# EAGLE design Remora (EAGLE 7.4.0)
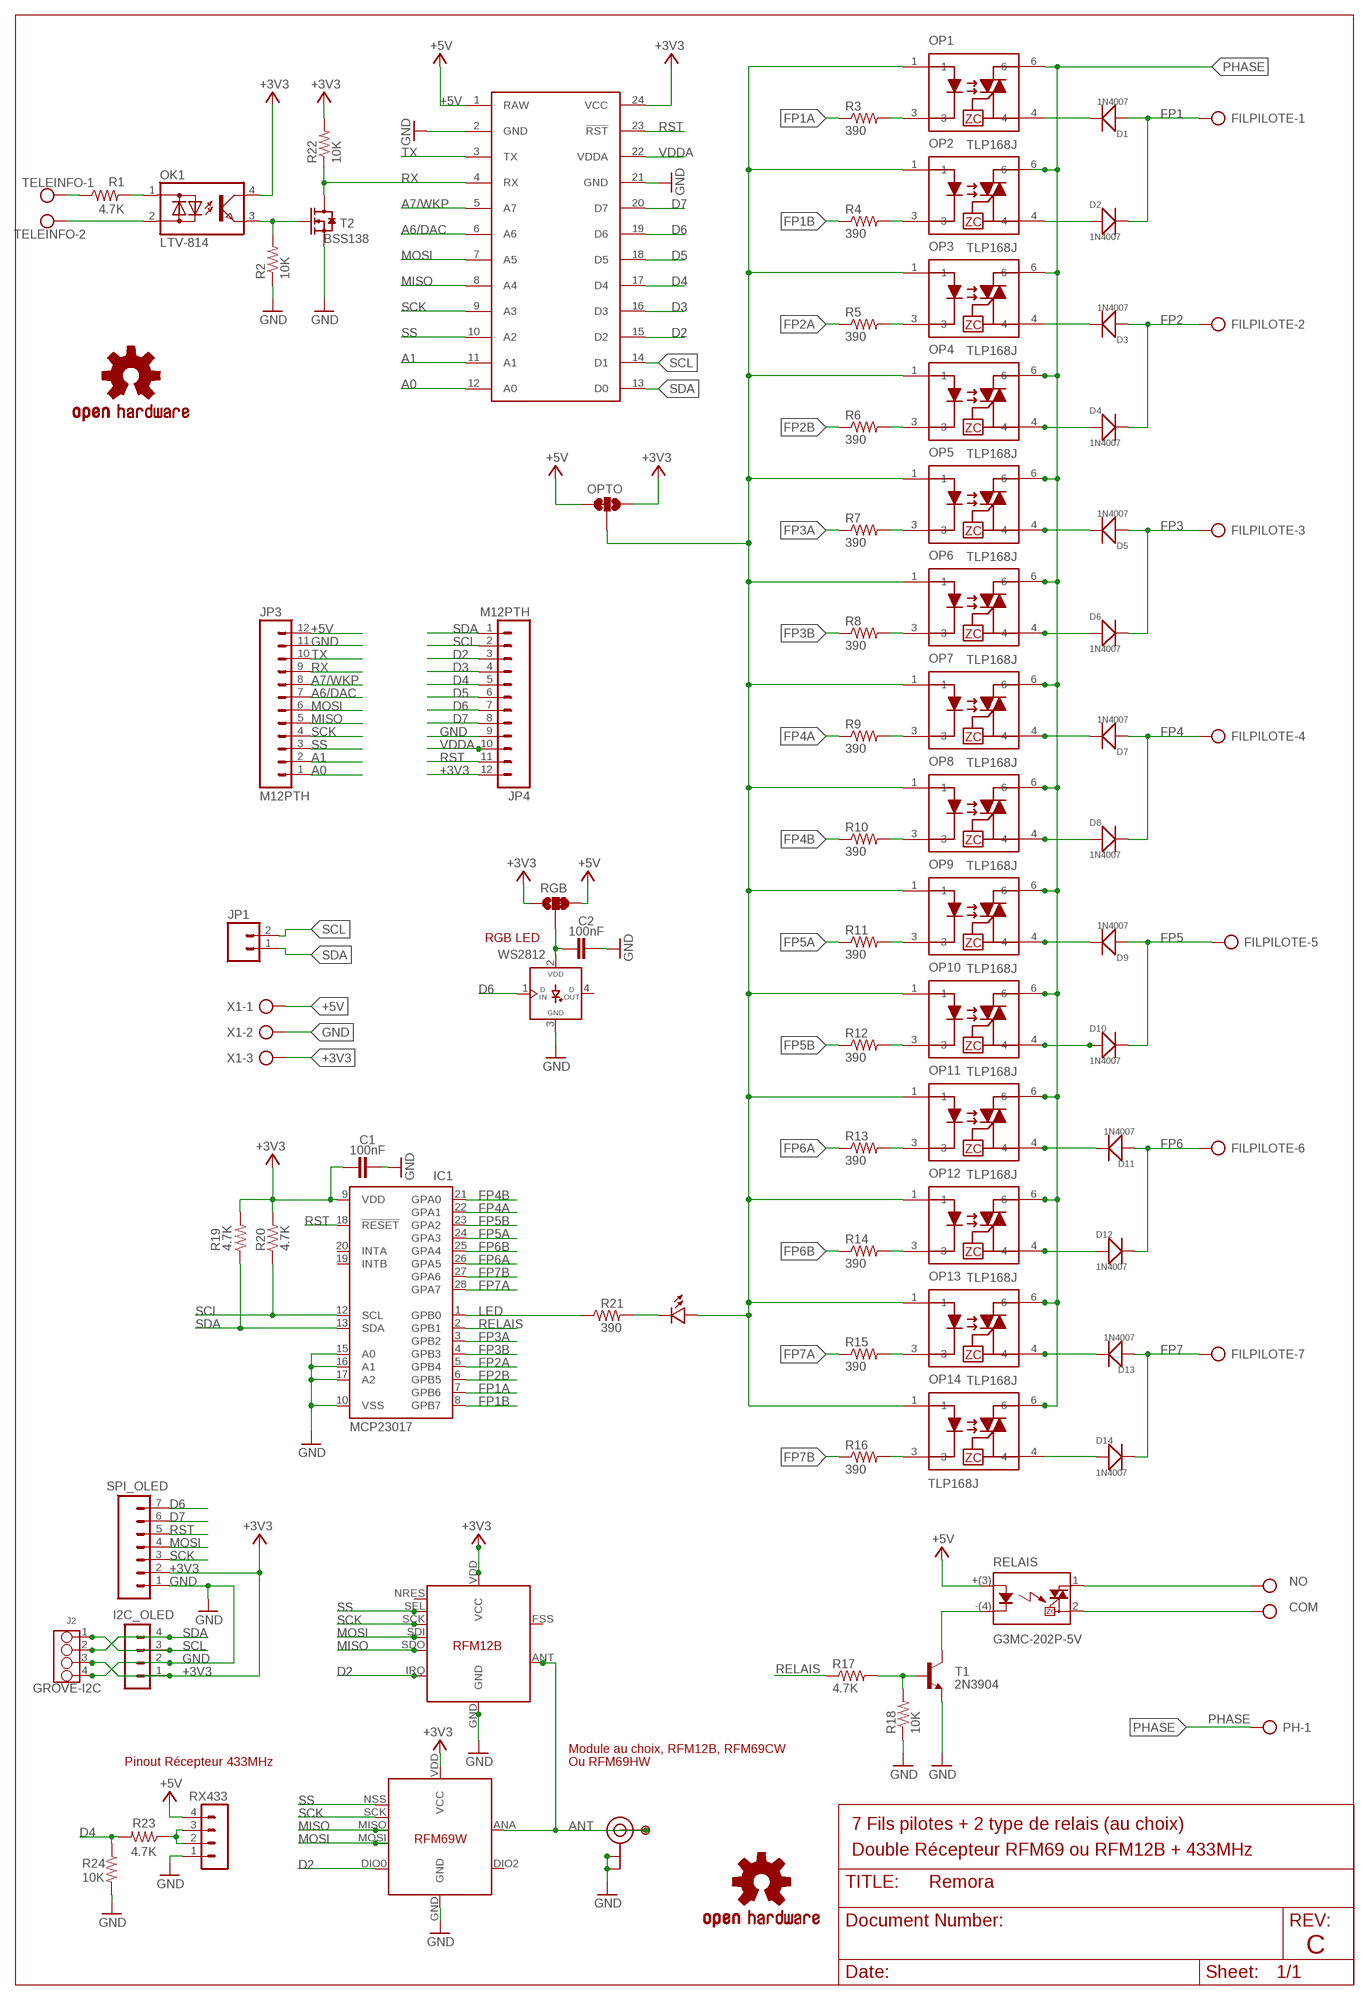
[diagram p0: schematic, sheet 1]

## Parts
C1  100nF  CAP'1206-CAP'  [1206-CAP]
C2  100nF  CAP'1206-CAP'  [1206-CAP]
D1  1N4007  DIODE'SMA'  [DO-214AC]
D2  1N4007  DIODE'SMA'  [DO-214AC]
D3  1N4007  DIODE'SMA'  [DO-214AC]
D4  1N4007  DIODE'SMA'  [DO-214AC]
D5  1N4007  DIODE'SMA'  [DO-214AC]
D6  1N4007  DIODE'SMA'  [DO-214AC]
D7  1N4007  DIODE'SMA'  [DO-214AC]
D8  1N4007  DIODE'SMA'  [DO-214AC]
D9  1N4007  DIODE'SMA'  [DO-214AC]
D10  1N4007  DIODE'SMA'  [DO-214AC]
D11  1N4007  DIODE'SMA'  [DO-214AC]
D12  1N4007  DIODE'SMA'  [DO-214AC]
D13  1N4007  DIODE'SMA'  [DO-214AC]
D14  1N4007  DIODE'SMA'  [DO-214AC]
FILPILOTE  AK500/7  [AK500/7]
I2C_OLED  CON_HEADER_1X04'SMALL''  [M1X4]
IC1  MCP23017  MCP23017SP  [DIL28-3]
J2  GROVE-I2C  GROVE-4P-2.0-3470130P1  [4P-2.0]
JP1  M02PTH  [1X02]
JP3  M12PTH  [1X12-SMALL-PADS]
JP4  M12PTH  [1X12-SMALL-PADS]
LED  LED3MM  [LED3MM]
LOGO1  OSHW-LOGOL  [OSHW-LOGO-L]
LOGO2  OSHW-LOGOL  [OSHW-LOGO-L]
OK1  LTV-814  SFH6206  [DIL4-SMD]
OP1  TLP168J  TLP168JBIGPAD  [MFSOP-4-HANDSOLDER]
OP2  TLP168J  TLP168JBIGPAD  [MFSOP-4-HANDSOLDER]
OP3  TLP168J  TLP168JBIGPAD  [MFSOP-4-HANDSOLDER]
OP4  TLP168J  TLP168JBIGPAD  [MFSOP-4-HANDSOLDER]
OP5  TLP168J  TLP168JBIGPAD  [MFSOP-4-HANDSOLDER]
OP6  TLP168J  TLP168JBIGPAD  [MFSOP-4-HANDSOLDER]
OP7  TLP168J  TLP168JBIGPAD  [MFSOP-4-HANDSOLDER]
OP8  TLP168J  TLP168JBIGPAD  [MFSOP-4-HANDSOLDER]
OP9  TLP168J  TLP168JBIGPAD  [MFSOP-4-HANDSOLDER]
OP10  TLP168J  TLP168JBIGPAD  [MFSOP-4-HANDSOLDER]
OP11  TLP168J  TLP168JBIGPAD  [MFSOP-4-HANDSOLDER]
OP12  TLP168J  TLP168JBIGPAD  [MFSOP-4-HANDSOLDER]
OP13  TLP168J  TLP168JBIGPAD  [MFSOP-4-HANDSOLDER]
OP14  TLP168J  TLP168JBIGPAD  [MFSOP-4-HANDSOLDER]
OPTO  JUMPER-PAD-3-2OF3_NC_BY_TRACE_LARGE  [PAD-JUMPER-3-2OF3_NC_BY_TRACE_YES_SILK_LARGE]
P1  PADSMALL  [PAD-SMALL]
PARTICLE  Spark/Photon  SPARK_CORECORE  [SPARK_CORE]
PH  AK500/3  [AK500/3]
R1  4.7K  RESISTOR'1206-RES''  [1206-RES]
R2  10K  RESISTOR'1206-RES''  [1206-RES]
R3  390  RESISTOR'1206-RES''  [1206-RES]
R4  390  RESISTOR'1206-RES''  [1206-RES]
R5  390  RESISTOR'1206-RES''  [1206-RES]
R6  390  RESISTOR'1206-RES''  [1206-RES]
R7  390  RESISTOR'1206-RES''  [1206-RES]
R8  390  RESISTOR'1206-RES''  [1206-RES]
R9  390  RESISTOR'1206-RES''  [1206-RES]
R10  390  RESISTOR'1206-RES''  [1206-RES]
R11  390  RESISTOR'1206-RES''  [1206-RES]
R12  390  RESISTOR'1206-RES''  [1206-RES]
R13  390  RESISTOR'1206-RES''  [1206-RES]
R14  390  RESISTOR'1206-RES''  [1206-RES]
R15  390  RESISTOR'1206-RES''  [1206-RES]
R16  390  RESISTOR'1206-RES''  [1206-RES]
R17  4.7K  RESISTOR'1206-RES''  [1206-RES]
R18  10K  RESISTOR'1206-RES''  [1206-RES]
R19  4.7K  RESISTOR'1206-RES''  [1206-RES]
R20  4.7K  RESISTOR'1206-RES''  [1206-RES]
R21  390  RESISTOR'1206-RES''  [1206-RES]
R22  10K  RESISTOR'1206-RES''  [1206-RES]
R23  4.7K  RESISTOR'1206-RES''  [1206-RES]
R24  10K  RESISTOR'1206-RES''  [1206-RES]
RELAIS  G3MC-202P-5V  G3MC-202P  [SIP-4]
RGB  JUMPER-PAD-3-2OF3_NC_BY_TRACE_SMALL  [PAD-JUMPER-3-2OF3_NC_BY_TRACE_YES_SILK_FULL_BOX]
RX433  CON_HEADER_1X04'NO_LOCK'  [1X04_NO_LOCK]
SPI_OLED  CON_HEADER_1X07'SMALL'  [M1X7]
T1  2N3904  2N2222-NPN-TO92-EBC  [TO92-EBC]
T2  BSS138  MOSFET-N-''  [SOT23]
TELEINFO  AK500/2  [AK500/2]
U$2  RFM12B  [RFM12B-MINPADS]
U$3  RFM69W  [RFM69W-MINPADS]
U-FL  U.FL  [U.FL]
WS2812  RGB LED  WS2812B5MM  [WS2812-PTH]
X1  AK500/3  [AK500/3]

## Nets
+3V3: C1.1 I2C_OLED.1 IC1.9(VDD) J2.3 JP4.12 OK1.4(C) OPTO.1 PARTICLE.24(VCC) R19.2 R20.2 R22.2 RGB.1 SPI_OLED.2 U$2.VDD(VCC) U$3.VDD(VCC) X1.3
+5V: JP3.12 OPTO.3 PARTICLE.1(RAW) RELAIS.+(3) RGB.3 RX433.4 X1.1
A0: JP3.1 PARTICLE.12(A0)
A1: JP3.2 PARTICLE.11(A1)
A6/DAC: JP3.7 PARTICLE.6(A6)
A7/WKP: JP3.8 PARTICLE.5(A7)
ANT: P1.1 U$2.ANT U$3.ANA(ANT) U-FL.3(SIGNAL)
COM: PH.3 RELAIS.2
D2: JP4.3 PARTICLE.15(D2) U$2.IRQ U$3.DIO0
D3: JP4.4 PARTICLE.16(D3)
D4: JP4.5 PARTICLE.17(D4) R23.2 R24.1
D5: JP4.6 PARTICLE.18(D5)
D6: JP4.7 PARTICLE.19(D6) SPI_OLED.7 WS2812.1(DIN)
D7: JP4.8 PARTICLE.20(D7) SPI_OLED.6
FP1: D1.1(+) D2.2(-) FILPILOTE.1
FP1A: IC1.7(GPB6) R3.1
FP1B: IC1.8(GPB7) R4.1
FP2: D3.1(+) D4.2(-) FILPILOTE.2
FP2A: IC1.5(GPB4) R5.1
FP2B: IC1.6(GPB5) R6.1
FP3: D5.1(+) D6.2(-) FILPILOTE.3
FP3A: IC1.3(GPB2) R7.1
FP3B: IC1.4(GPB3) R8.1
FP4: D7.1(+) D8.2(-) FILPILOTE.4
FP4A: IC1.22(GPA1) R9.1
FP4B: IC1.21(GPA0) R10.1
FP5: D9.1(+) D10.2(-) FILPILOTE.5
FP5A: IC1.24(GPA3) R11.1
FP5B: IC1.23(GPA2) R12.1
FP6: D11.1(+) D12.2(-) FILPILOTE.6
FP6A: IC1.26(GPA5) R13.1
FP6B: IC1.25(GPA4) R14.1
FP7: D13.1(+) D14.2(-) FILPILOTE.7
FP7A: IC1.28(GPA7) R15.1
FP7B: IC1.27(GPA6) R16.1
GND: C1.2 C2.2 I2C_OLED.2 IC1.10(VSS) IC1.15(A0) IC1.16(A1) IC1.17(A2) J2.4 JP3.11 JP4.9 PARTICLE.2(GND) PARTICLE.21(GND) R2.1 R18.1 R24.2 RX433.1 SPI_OLED.1 T1.E T2.2(S) U$2.GND U$3.GND U-FL.1(GND) U-FL.2(GND) WS2812.3(GND) X1.2
LED: IC1.1(GPB0) R21.1
MISO: JP3.5 PARTICLE.8(A4) U$2.SDO U$3.MISO
MOSI: JP3.6 PARTICLE.7(A5) SPI_OLED.4 U$2.SDI U$3.MOSI
N$1: D1.2(-) OP1.4
N$2: D2.1(+) OP2.4
N$3: OK1.2(AC2) TELEINFO.2
N$4: OK1.1(AC1) R1.2
N$5: R1.1 TELEINFO.1
N$6: LED.MINUS R21.2
N$7: OP1.3 R3.2
N$8: OP2.3 R4.2
N$9: OP3.3 R5.2
N$10: OP4.3 R6.2
N$11: OP5.3 R7.2
N$12: OP6.3 R8.2
N$13: OP7.3 R9.2
N$14: OP8.3 R10.2
N$15: RELAIS.-(4) T1.C
N$16: C2.1 RGB.2 WS2812.2(VDD)
N$17: OK1.3(E) R2.2 T2.1(G)
N$18: OP9.3 R11.2
N$19: LED.PLUS OP1.1 OP2.1 OP3.1 OP4.1 OP5.1 OP6.1 OP7.1 OP8.1 OP9.1 OP10.1 OP11.1 OP12.1 OP13.1 OP14.1 OPTO.2
N$21: R17.2 R18.2 T1.B
N$22: D3.2(-) OP3.4
N$24: D5.2(-) OP5.4
N$25: D4.1(+) OP4.4
N$26: D7.2(-) OP7.4
N$29: D6.1(+) OP6.4
N$31: D8.1(+) OP8.4
N$32: OP10.3 R12.2
N$34: OP14.3 R16.2
N$42: D9.2(-) OP9.4
N$47: OP11.3 R13.2
N$48: OP12.3 R14.2
N$49: D10.1(+) OP10.4
N$51: D12.1(+) OP12.4
NO: PH.2 RELAIS.1
PHASE: OP1.6 OP2.6 OP3.6 OP4.6 OP5.6 OP6.6 OP7.6 OP8.6 OP9.6 OP10.6 OP11.6 OP12.6 OP13.6 OP14.6 PH.1
RELAIS: IC1.2(GPB1) R17.1
RST: IC1.18(!RESET) JP4.11 PARTICLE.23(!RST) SPI_OLED.5
RX: JP3.9 PARTICLE.4(RX) R22.1 T2.3(D)
RX433: R23.1 RX433.2 RX433.3
S$1: D11.2(-) OP11.4
S$3: D13.2(-) OP13.4
S$5: OP13.3 R15.2
S$11: D14.1(+) OP14.4
SCK: JP3.4 PARTICLE.9(A3) SPI_OLED.3 U$2.SCK U$3.SCK
SCL: I2C_OLED.3 IC1.12(SCL) J2.1 JP1.2 JP4.2 PARTICLE.14(D1) R20.1
SDA: I2C_OLED.4 IC1.13(SDA) J2.2 JP1.1 JP4.1 PARTICLE.13(D0) R19.1
SS: JP3.3 PARTICLE.10(A2) U$2.SEL U$3.NSS(SEL)
TX: JP3.10 PARTICLE.3(TX)
VDDA: JP4.10 PARTICLE.22(VDDA)
Unconnected: IC1.19(INTB) IC1.20(INTA) U$2.FSS(FFS) U$2.NRES U$3.DIO2 WS2812.4(DOUT)

## Notes on the sheet
- RGB LED
- Module au choix, RFM12B, RFM69CW
- Pinout Récepteur 433MHz | Ou RFM69HW
- 7 Fils pilotes + 2 type de relais (au choix)
- Double Récepteur RFM69 ou RFM12B + 433MHz
- C

## Library data of the parts
C1 C2 = _c2h:CAP: Capacitor Standard 0603 ceramic capacitor, and 0.1" leaded capacitor.
D1-D14 = seeed-opl-Discrete:DIODE*
FILPILOTE = con-ptr500:AK500/7: CONNECTOR; OC_FARNELL: unknown; OC_NEWARK: unknown
I2C_OLED RX433 = _c2h:CON_HEADER_1X04
IC1 = adafruit:MCP23017: http://ww1.microchip.com/downloads/en/DeviceDoc/21952a.pdf Source: http://ww1.microchip.com/downloads/en/DeviceDoc/21952a.pdf
J2 = seeed-opl-Connector:GROVE-4P-2.0
JP1 = SparkFun-Connectors:M02: Standard 2-pin 0.1" header. Use with - straight break away headers ( PRT-00116) - right angle break away headers (PRT-00553) - swiss pins (PRT-00743) - machine pins (PRT-00117) - female headers (PRT-00115) Molex polarized connector foot print use with: PRT-08233 with associated crimp pins and housings. 2.54_SCREWTERM for use with PRT-10571. 3.5mm Screw Terminal footprints for PRT-08084 5mm Screw Terminal footprints for use with PRT-08432
JP3 JP4 = Spark:M12: Header 12 Standard 12-pin 0.1" header. Use with straight break away headers (SKU : PRT-00116), right angle break away headers (PRT-00553), swiss pins (PRT-00743), machine pins (PRT-00117), and female headers (PRT-00115).
LED = _c2h:LED
LOGO1 LOGO2 = SparkFun-Aesthetics:OSHW-LOGO: Open Source Hardware Logo This logo indicates the piece of hardware it is found on incorporates a OSHW license and/or adheres to the definition of open source hardware found here: http://freedomdefined.org/OSHW
OK1 = optocoupler:SFH620: Optocoupler, Phototransistor Output, AC Input Source: http://www.vishay.com/docs/83675/sfh620.pdf; MF: VISHAY/TELEFUNKEN; MPN: SFH6206-3; OC_FARNELL: 1469585; OC_NEWARK: 58K2214
OP1-OP14 = TLP168J:TLP168J
OPTO RGB = SparkFun-Passives:JUMPER-PAD-3-2OF3_NC_BY_TRACE
P1 = SteveMarple:PAD
PARTICLE = Spark:SPARK_CORE
PH X1 = con-ptr500:AK500/3: CONNECTOR; OC_FARNELL: unknown; OC_NEWARK: unknown
R1-R24 = _c2h:RESISTOR: Resistor Basic schematic elements and footprints for 0603, 1206, and PTH resistors.
RELAIS = sip-4:G3MC-202P
SPI_OLED = _c2h:CON_HEADER_1X07
T1 = transistor-neu-to92:*-NPN-: NPN Transistror
T2 = Seeed-Discrete:MOSFET-N: CJ2302：SMD MOSFET N-CH 20V-2.1A
TELEINFO = con-ptr500:AK500/2: CONNECTOR; OC_FARNELL: unknown; OC_NEWARK: unknown
U$2 = _c2h:RFM12B
U$3 = _c2h:RFM69W
U-FL = microbuilder:U.FL: U.FL Antenna Connector
WS2812 = _c2h:WS2812B

## Net classes
0 default: width 0.203 mm, drill 0.305 mm, clearance 0.254 mm

## Board
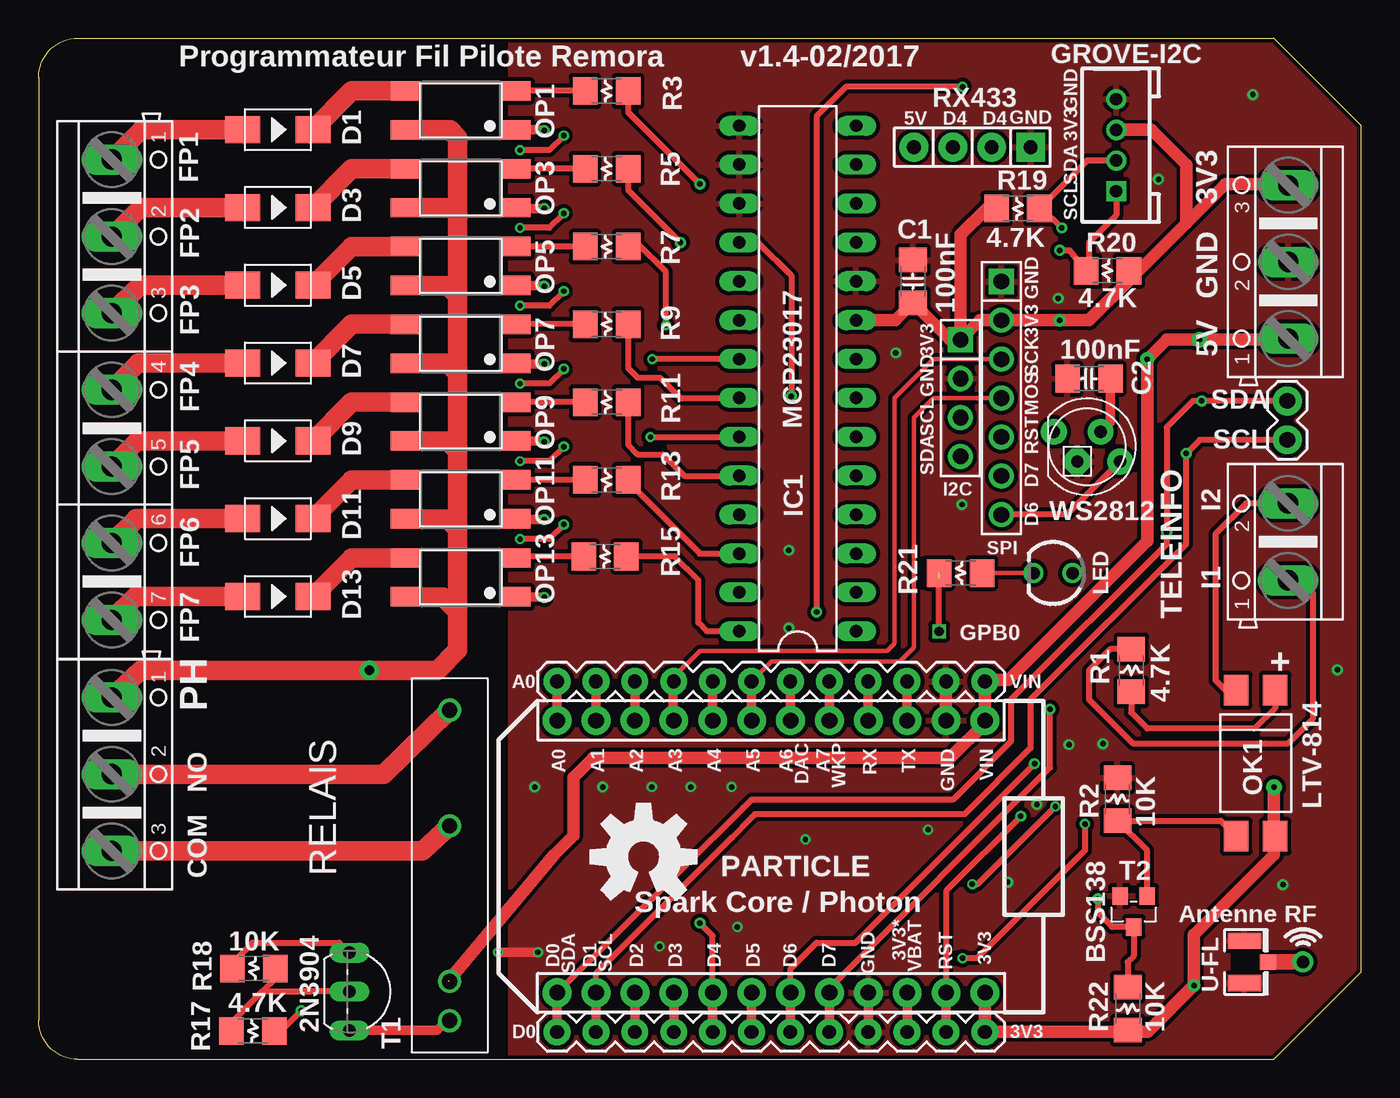
[diagram p1: board, top side]
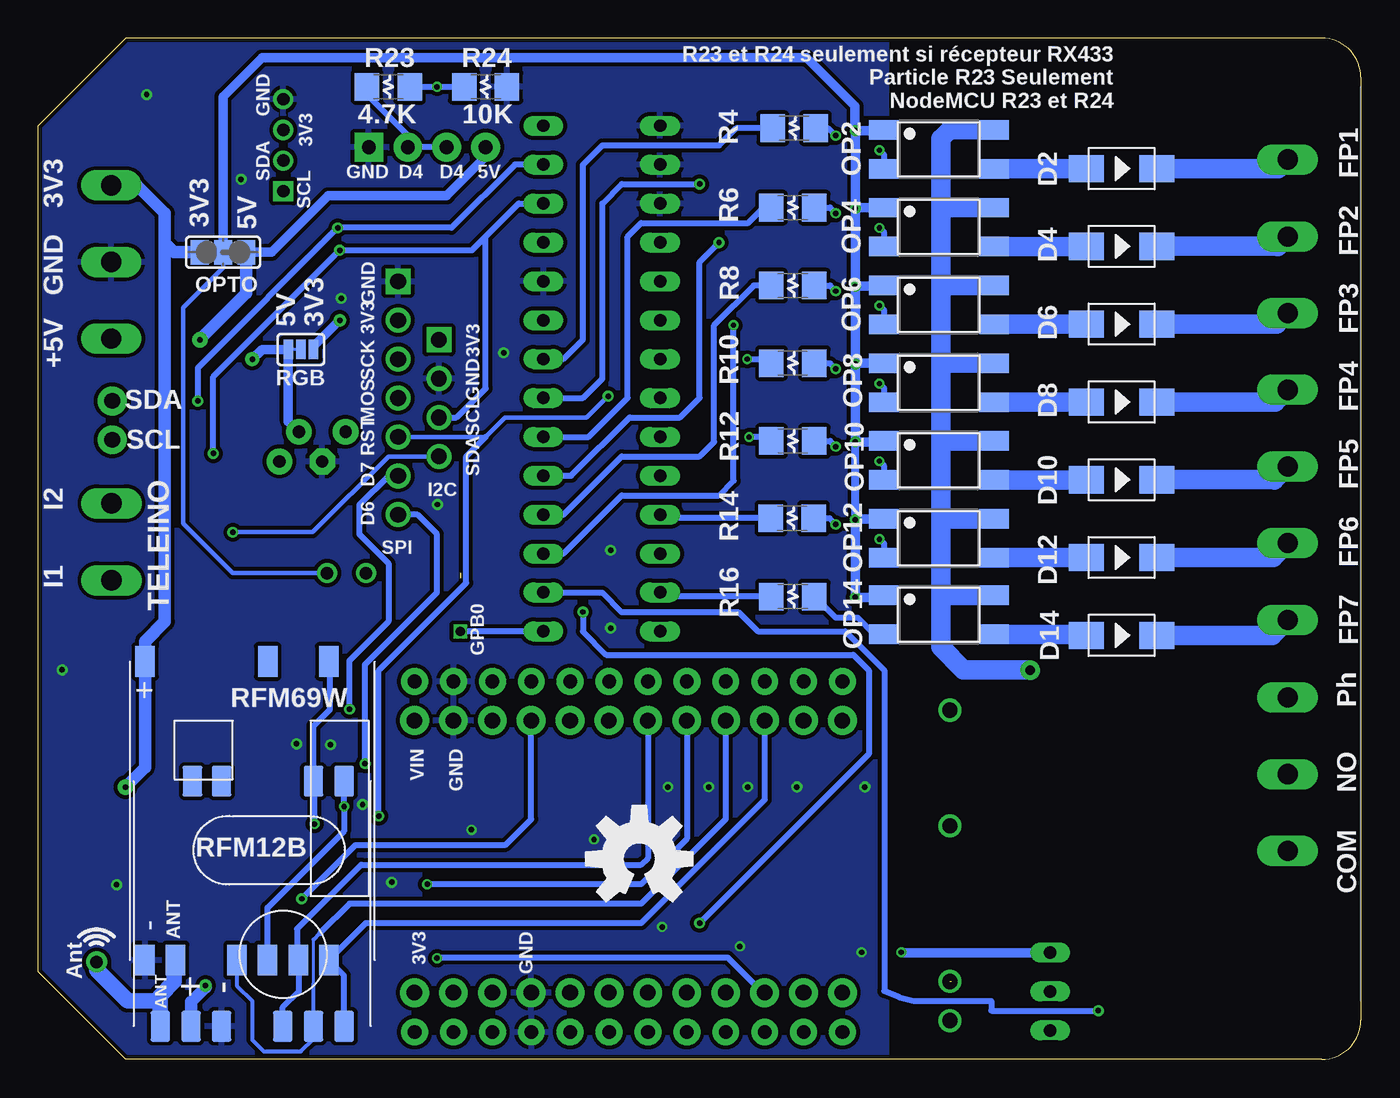
[diagram p2: board, bottom side, seen from below]

Size 86.36 x 66.67 mm. Coordinates in mm from the lower left corner, seen from the top.
Outline: 2.54,0 80.64,0 86.36,5.71 86.36,60.96 80.64,66.67 2.54,66.67 arc90 0,64.14 0,2.54 arc90 2.54,0
Copper layers (1*16): Top 0.035mm / dielectric 1.5mm / Bottom 0.035mm
Design rules "SeeedStudio_2layer_DRU_no_angle_20140221": minimum track width 6mil, minimum drill 12mil, track to track 6mil, track to pad 6mil, pad to pad 6mil, via to via 6mil, smd to smd 0mil, copper to edge 10mil, drill to drill 10mil, minimum pad ring 10mil, minimum via ring 6mil, stop-mask expansion 2mil, vias tented up to drill 100mil, thermal gap 10mil

### Footprints (pad centres in the part's own frame; a part is rotated, then mirrored left to right if it is on the bottom)
1206-CAP = smd 1.6 x 1.8: 1 -1.4,0; 2 1.4,0
DO-214AC = smd 2.286 x 1.77: 1 -2.296,0; 2 2.296,0
AK500/7 = drill 1.321 long: 1 -15.037,0; 2 -10.008,0; 3 -5.004,0; 4 0,0; 5 5.004,0; 6 10.008,0; 7 15.037,0
M1X4 = drill 1.02 pad 1.632 square: 1 -3.81,0 | drill 1.02 pad 1.632: 2 -1.27,0; 3 1.27,0; 4 3.81,0
DIL28-3 = drill 0.813 long: 1 -16.51,-3.81; 2 -13.97,-3.81; 3 -11.43,-3.81; 4 -8.89,-3.81; 5 -6.35,-3.81; 6 -3.81,-3.81; 7 -1.27,-3.81; 8 1.27,-3.81; 9 3.81,-3.81; 10 6.35,-3.81; 11 8.89,-3.81; 12 11.43,-3.81; 13 13.97,-3.81; 14 16.51,-3.81; 15 16.51,3.81; 16 13.97,3.81; 17 11.43,3.81; 18 8.89,3.81; 19 6.35,3.81; 20 3.81,3.81; 21 1.27,3.81; 22 -1.27,3.81; 23 -3.81,3.81; 24 -6.35,3.81; 25 -8.89,3.81; 26 -11.43,3.81; 27 -13.97,3.81; 28 -16.51,3.81
4P-2.0 = drill 0.8 pad 1.27 square: 1 -3,0 | drill 0.8 pad 1.27: 2 -1,0; 3 1,0; 4 3,0
1X02 = drill 1.016 pad 1.88: 1 0,0; 2 2.54,0
1X12-SMALL-PADS = drill 0.889 pad 1.753: 1 0,0; 2 2.54,0; 3 5.08,0; 4 7.62,0; 5 10.16,0; 6 12.7,0; 7 15.24,0; 8 17.78,0; 9 20.32,0; 10 22.86,0; 11 25.4,0; 12 27.94,0
LED3MM = drill 0.813: MINUS 1.27,0; PLUS -1.27,0
DIL4-SMD = smd 1.6 x 2: 1 -1.27,-4.77; 2 1.27,-4.77; 3 1.27,4.77; 4 -1.27,4.77
MFSOP-4-HANDSOLDER = smd 1.27 x 2.032: 1 2.54,0.381; 3 0,0.381; 4 0,-6.731; 6 2.54,-6.731
PAD-JUMPER-3-2OF3_NC_BY_TRACE_YES_SILK_LARGE = smd 1.168 x 1.6: 1 -1.524,0; 2 0,0; 3 1.524,0
PAD-SMALL = drill 0.813 pad 1.372: 1 0,0
SPARK_CORE = drill 1.016 pad 1.88: 1 -8.89,13.97; 2 -8.89,11.43; 3 -8.89,8.89; 4 -8.89,6.35; 5 -8.89,3.81; 6 -8.89,1.27; 7 -8.89,-1.27; 8 -8.89,-3.81; 9 -8.89,-6.35; 10 -8.89,-8.89; 11 -8.89,-11.43; 12 -8.89,-13.97; 13 8.89,-13.97; 14 8.89,-11.43; 15 8.89,-8.89; 16 8.89,-6.35; 17 8.89,-3.81; 18 8.89,-1.27; 19 8.89,1.27; 20 8.89,3.81; 21 8.89,6.35; 22 8.89,8.89; 23 8.89,11.43; 24 8.89,13.97
AK500/3 = drill 1.321 long: 1 -5.004,0; 2 0,0; 3 5.004,0
1206-RES = smd 1.6 x 1.8: 1 -1.4,0; 2 1.4,0
SIP-4 = drill 1: 1 10.1,-0.04; 2 2.54,-0.04; +(3) -7.62,-0.04; -(4) -10.18,-0.04
PAD-JUMPER-3-2OF3_NC_BY_TRACE_YES_SILK_FULL_BOX = smd 0.635 x 1.27: 1 -0.813,0; 2 0,0; 3 0.813,0
1X04_NO_LOCK = drill 0.9 pad 1.88 square: 1 -3.816,-0.121 | drill 0.9 pad 1.88: 2 -1.27,-0.133; 3 1.27,-0.121; 4 3.81,-0.133
M1X7 = drill 1.02 pad 1.632 square: 1 -6.35,0 | drill 1.02 pad 1.632: 2 -3.81,0; 3 -1.27,0; 4 1.27,0; 5 3.81,0; 6 6.35,0; 7 8.89,0
TO92-EBC = drill 0.813 long: B 0,-1.27; C 2.54,-1.27; E -2.54,-1.27
SOT23 = smd 1.016 x 1.143: 1 -0.889,-1.016; 2 0.889,-1.016; 3 0,1.016
AK500/2 = drill 1.321 long: 1 -2.515,0; 2 2.515,0
RFM12B-MINPADS = smd 2 x 1.27: ANT 8,-6; FSS -8.002,-2; GND 8,-2; IRQ -8,4; NRES -8.002,-3.905; SCK 8,4; SDI 8,2; SDO -8,6; SEL 8,6; VDD 8,-4
RFM69W-MINPADS = smd 2 x 1.27: ANA 8,-5; DIO0 -11.5,5; DIO2 -11.5,1.012; GND 8,-7; MISO 8,1; MOSI 8,3; NSS 8,5; SCK 8,-1; VDD -11.5,-7
U.FL = smd 2.2 x 1.05: 1 0,1.375; 2 0,-1.375 | smd 1.05 x 1: 3 1.525,0
WS2812-PTH = drill 0.8 pad 1.676: 1 2.159,-0.968; 2 0.889,0.968; 4 -2.159,0.968 | drill 0.8 pad 1.676 octagon: 3 -0.635,-0.968

### Placement (x,y rotation side)
C1  57.09,50.8 90 top
C2  68.58,44.45 180 top
D1  15.62,60.71 0 top
D2  15.62,58.17 0 bottom
D3  15.62,55.63 0 top
D4  15.62,53.09 0 bottom
D5  15.62,50.55 0 top
D6  15.62,48.01 0 bottom
D7  15.62,45.47 0 top
D8  15.62,42.93 0 bottom
D9  15.62,40.39 0 top
D10  15.62,37.85 0 bottom
D11  15.62,35.31 0 top
D12  15.62,32.77 0 bottom
D13  15.62,30.23 0 top
D14  15.62,27.69 0 bottom
FILPILOTE  4.78,43.72 270 top
I2C_OLED  60.2,43.18 270 top
IC1  49.57,44.46 90 top
J2  70.36,59.69 90 top
JP1  81.53,42.99 270 top
JP3  33.85,24.67 0 top
JP4  33.85,1.78 0 top
LED  66.23,31.75 180 top
LOGO1  39.5,13.21 0 top
LOGO2  47.12,13.08 0 bottom
OK1  79.47,19.34 180 top
OP1  30.73,63.23 270 top
OP2  30.73,58.16 90 bottom
OP3  30.73,58.16 270 top
OP4  30.73,53.08 90 bottom
OP5  30.73,53.08 270 top
OP6  30.73,47.99 90 bottom
OP7  30.73,47.99 270 top
OP8  30.73,42.91 90 bottom
OP9  30.73,42.91 270 top
OP10  30.73,37.84 90 bottom
OP11  30.73,37.84 270 top
OP12  30.73,32.76 90 bottom
OP13  30.73,32.73 270 top
OP14  30.73,27.75 90 bottom
OPTO  74.3,52.7 0 bottom
P1  82.55,6.35 0 top
PARTICLE  47.83,13.23 270 top
PH  4.78,18.62 270 top
R1  71.34,25.39 270 top
R2  70.44,16.98 270 top
R3  37.09,63.23 180 top
R4  37,60.8 0 bottom
R5  37.09,58.16 180 top
R6  37.09,55.62 0 bottom
R7  37.09,53.08 180 top
R8  37.09,50.53 0 bottom
R9  37.09,47.99 180 top
R10  37.09,45.45 0 bottom
R11  37.09,42.91 180 top
R12  37.09,40.38 0 bottom
R13  37.09,37.84 180 top
R14  37.13,35.33 0 bottom
R15  36.98,32.84 180 top
R16  37.09,30.21 0 bottom
R17  13.99,1.86 180 top
R18  14.06,5.93 0 top
R19  63.94,55.56 180 top
R20  69.79,51.5 0 top
R21  60.2,31.75 0 top
R22  71.12,3.3 270 top
R23  63.5,63.5 0 bottom
R24  57.15,63.5 0 bottom
RELAIS  26.8,12.7 90 top
RGB  69.22,46.35 180 bottom
RX433  60.96,59.44 180 top
SPI_OLED  62.87,44.45 270 top
T1  21.56,4.42 270 top
T2  71.5,9.65 180 top
TELEINFO  81.58,33.79 90 top
U$2  72.39,10.16 270 bottom
U$3  72.39,14.48 270 bottom
U-FL  78.74,6.35 0 top
WS2812  68.45,40.01 0 top
X1  81.6,52.07 90 top

### Tracks (layer width: path | path; a pad name or v marks a point on that pad's centre or on a via)
+3V3  (via drill 0.36 pad 0.81, 0.36 pad 1.02)
  Top 0.406: R22.2 71.12,1.81 | R19.2 62.54,54.92 | 57.22,49.53 C1.1 | R20.2 71.19,51.37 71.44,51.12 | OK1.4 80.74,14.05 80.66,13.97
  Top 0.813: 61.82,4.32 PARTICLE.24 | 61.82,4.37 PARTICLE.24 | 74.93,54.61 71.44,51.12 68.58,48.26 v66.67,48.26 SPI_OLED.2 61.47,48.26 I2C_OLED.1 | 74.93,54.61 74.93,58.42 72.66,60.69 J2.3 | PARTICLE.24 JP4.12 61.78,1.81 71.12,1.81 72.42,1.81 v75.44,4.83 75.44,8.13 80.66,13.35 80.66,13.97 v80.66,17.78 | IC1.9 55.95,48.27 C1.1 59.5,46.99 I2C_OLED.1 | I2C_OLED.1 60.2,53.85 61.91,55.56 R19.2 | 74.93,54.61 77.47,57.15 81.2,57.15 X1.3
  Bottom 0.61: RGB.1 68.4,46.53 v66.67,48.26
  Bottom 0.813: v75.44,4.83 75.44,4.7 76.39,3.75 U$2.VDD | 78.11,53.34 78.11,28.57 79.39,27.29 U$3.VDD 79.39,19.05 v80.66,17.78 | 78.11,53.34 78.11,55.24 79.93,57.07 X1.3 | OPTO.1 77.47,52.7 78.11,53.34
+5V  (via drill 0.36 pad 0.91, 0.36 pad 1.02)  (1 unrouted)
  Top 0.813: PARTICLE.1 61.9,22.02 59.5,19.67 36.2,19.67 34.92,18.4 34.92,14.61 33.66,13.34 26.72,5.11 | 61.78,22.13 PARTICLE.1 | PARTICLE.1 JP3.12 61.88,24.77 63.31,24.77 72.39,33.85 v72.39,45.72 73.66,46.99 v75.82,46.99 81.52,46.99 X1.1
  Bottom 0.305: RX433.4 57.15,59.44
  Bottom 0.61: 57.15,59.44 57.15,58.93 59.69,56.39 67.44,56.39 71.12,52.7 OPTO.3 | RGB.3 71.75,46.35 v72.39,45.72
  Bottom 0.813: OPTO.3 72.77,50.04 v75.82,46.99
A0
  Top 0.61: JP3.1 33.85,22.13 PARTICLE.12
A1
  Top 0.61: JP3.2 36.39,22.13 PARTICLE.11
A6/DAC
  Top 0.61: JP3.7 49.09,22.13 PARTICLE.6
A7/WKP
  Top 0.61: JP3.8 51.63,22.13 PARTICLE.5
ANT
  Top 1.016: U-FL.3 P1.1
  Bottom 1.016: U$2.ANT 78.39,3.56 | 78.39,3.56 78.39,4.16 77.47,5.08 77.47,6.4 U$3.ANA | P1.1 82.55,5.84 80.52,3.81 78.64,3.81 78.39,3.56
COM
  Top 1.27: PH.3 25.08,13.61 RELAIS.2
D2  (via drill 0.36)
  Top 0.406: v68.33,15.37 68.33,13.65 61.28,6.6 v60.33,6.6
  Top 0.61: JP4.3 PARTICLE.15
  Bottom 0.406: PARTICLE.15 39.05,4.34 41.34,6.64 60.29,6.64 v60.33,6.6 | U$3.DIO0 67.31,25.9 67.31,22.86 68.39,21.78 U$2.IRQ 68.33,18.1 v68.33,15.37
D3
  Top 0.61: JP4.4 PARTICLE.16
D4  (via drill 0.36 pad 0.61, 0.36 pad 0.71)
  Top 0.406: 44.04,4.32 PARTICLE.17 44.02,8.05 v43.18,8.89 | v50.8,29.21 50.8,61.59 52.7,63.5 v60.33,63.5
  Top 0.61: JP4.5 PARTICLE.17
  Bottom 0.406: v50.8,29.21 50.8,27.94 49.28,26.42 33.15,26.42 32.13,25.4 32.13,19.94 v43.18,8.89 | R24.1 v60.33,63.5 R23.2
D5
  Top 0.61: JP4.6 PARTICLE.18
D6  (via drill 0.36 pad 0.71)
  Top 0.406: 49.12,4.32 PARTICLE.19 49.09,5.92 50.8,7.62 53.34,7.62 v65.02,19.3 | SPI_OLED.7 67.14,35.56 WS2812.1
  Top 0.61: JP4.7 PARTICLE.19
  Bottom 0.406: v65.02,19.3 65.02,25.78 60.33,30.48 60.33,34.29 61.59,35.56 SPI_OLED.7
D7  (via drill 0.36 pad 0.71)
  Top 0.406: 51.66,4.32 PARTICLE.20 51.63,4.64 66.04,19.05 v66.04,22.86
  Top 0.61: JP4.8 PARTICLE.20
  Bottom 0.406: v66.04,22.86 66.04,26.04 63.5,28.57 63.5,32.38 65.41,34.29 65.41,36.2 63.5,38.1 SPI_OLED.6
FP1
  Top 1.27: FILPILOTE.1 6.71,60.7 13.58,60.7 D1.1
  Bottom 1.27: FILPILOTE.1 5.38,58.16 5.71,58.17 D2.2
FP1A  (via drill 0.36 pad 0.71)
  Top 0.406: R3.1 38.48,61.84 v43.18,57.15
  Bottom 0.406: IC1.7 50.8,43.19 49.53,44.45 49.53,55.88 48.26,57.15 v43.18,57.15
FP1B
  Bottom 0.406: IC1.8 52.06,45.73 50.8,46.99 50.8,58.42 49.53,59.69 41.91,59.69 40.8,60.8 R4.1
FP2
  Top 1.27: FILPILOTE.2 6.66,55.62 6.66,55.63 D3.1
  Bottom 1.27: FILPILOTE.2 5.43,53.08 5.76,53.09 D4.2
FP2A  (via drill 0.36 pad 0.71)
  Top 0.406: R5.1 38.48,56.77 v41.91,53.34
  Bottom 0.406: v41.91,53.34 43.18,52.07 43.18,43.18 44.45,41.91 47.75,41.91 51.56,38.1 IC1.5
FP2B
  Bottom 0.406: IC1.6 50.41,40.65 47.88,43.18 47.88,53.72 46.99,54.61 40.01,54.61 39,55.62 R6.1
FP3
  Top 1.27: FILPILOTE.3 6.59,50.53 6.59,50.55 D5.1
  Bottom 1.27: 5.5,47.99 5.49,48.01 | D6.2 5.49,48.01 | 5.49,48.01 FILPILOTE.3
FP3A  (via drill 0.33 pad 0.61)
  Top 0.406: v40.96,47.94 40.96,51.44 39.05,53.34 38.75,53.34 R7.1
  Bottom 0.406: v40.96,47.94 40.96,37.78 41.91,36.83 48.26,36.83 52.06,33.02 IC1.3
FP3B
  Bottom 0.406: 38.55,50.58 R8.1 39.63,50.53 42.23,47.94 42.23,40.32 43.18,39.37 48.26,39.37 52.06,35.56 IC1.4
FP4
  Top 1.27: FILPILOTE.4 6.51,45.45 6.51,45.47 D7.1
  Bottom 1.27: FILPILOTE.4 5.58,42.91 5.91,42.93 D8.2
FP4A
  Top 0.406: R9.1 38.48,45.15 39.12,44.51 40.58,44.51 41.91,43.18 IC1.22
FP4B  (via drill 0.33 pad 0.36)
  Top 0.406: v40.07,45.72 v40.07,45.73 IC1.21
  Bottom 0.406: v40.07,45.72 38.77,45.72 R10.1
FP5
  Top 1.27: FILPILOTE.5 6.43,40.38 6.75,40.39 D9.1
  Bottom 0.813: 4.25,38.73 FILPILOTE.5
  Bottom 1.27: 5.66,37.84 5.64,37.85 | 5.64,37.85 FILPILOTE.5 | D10.2 5.64,37.85
FP5A
  Top 0.406: R11.1 38.48,40.13 39.12,39.5 40.77,39.5 42.16,38.1 IC1.24
FP5B  (via drill 0.33 pad 0.61)
  Top 0.406: v39.94,40.64 IC1.23
  Bottom 0.406: R12.1 38.85,40.63 v39.94,40.64
FP6
  Top 1.27: FILPILOTE.6 6.36,35.3 6.36,35.31 D11.1
  Bottom 1.27: 5.73,32.76 5.72,32.77 | 5.72,32.77 FILPILOTE.6 | D12.2 5.72,32.77
FP6A
  Top 0.406: R13.1 38.48,37.72 43.18,33.02 IC1.26
FP6B
  Bottom 0.406: R14.1 45.52,35.33 IC1.25
FP7
  Top 1.27: FILPILOTE.7 6.39,30.3 6.39,30.23 D13.1
  Bottom 1.27: FILPILOTE.7 5.77,27.69 D14.2
FP7A
  Top 0.406: IC1.28 43.64,27.95 43.07,28.51 43.07,31.3 41.52,32.85 38.4,32.85 R15.1
FP7B
  Bottom 0.406: R16.1 45.48,30.21 IC1.27
GND  (via drill 0.36, 0.36 pad 0.71)
  Top 0.406: R18.1 12.66,6.31 13.97,7.62 19.63,7.62 T1.E
  Top 0.61: JP4.9 PARTICLE.21 | v30,6.99 v32.61,6.99
  Top 0.813: JP3.11 PARTICLE.2
  Bottom 0.406: 29.79,6.96 v30,6.99
  Bottom 0.61: 29.79,6.96 T1.E
  other vias: 45.24,17.78 40.04,17.78 42.58,17.78 50.07,14.35 84.8,25.43 81.25,11.4 63.28,11.56 79.28,62.99 69.5,20.61 67.28,20.54 58.07,14.99 48.99,28.16 65.18,16.64 60.29,36.23 55.98,46.13 66.58,49.69 45.62,8.64 40.54,7.37 36.83,17.78 48.99,33.24 32.38,17.78 73.12,57.47
  pour Bottom: 88.27,68.58 88.27,-2.54 30.99,-2.67 30.99,68.45
  pour Top: 30.86,67.18 87,67.31 87,-1.27 30.86,-1.4
LED  (via drill 0.6)  (2 unrouted)
  Top 0.406: v58.8,27.94 R21.1
  Bottom 0.406: IC1.1 v58.8,27.94 58.42,27.94
MISO  (via drill 0.36)
  Top 0.406: v60.96,11.43 61.31,11.43 v66.39,16.51
  Top 0.61: JP3.5 44.01,22.13 PARTICLE.8
  Bottom 0.406: PARTICLE.8 44.02,14.4 46.99,11.43 v60.96,11.43 | 71.12,6.75 U$3.MISO 71.39,9.89 66.39,14.89 v66.39,16.51 U$2.SDO
MOSI
  Top 0.305: SPI_OLED.4 58.42,43.18 57.15,41.91 57.15,26.89 56.23,25.97 47.85,25.97 JP3.6 46.51,24.64 | 46.51,22.17 PARTICLE.7
  Top 0.61: JP3.6 46.55,22.13 PARTICLE.7
  Bottom 0.406: PARTICLE.7 46.55,13.13 46.99,12.7 65.28,12.7 69.47,8.51 69.47,6.56 U$3.MOSI 69.34,6.43 69.34,4.45 70.39,3.4 U$2.SDI
N$1
  Top 1.27: OP1.4 20.45,63.23 D1.2
N$2
  Bottom 1.27: OP2.4 17.66,58.16 D2.1
N$3
  Top 0.406: OK1.2 77.56,24.13 77.47,24.23 77.47,24.13 76.83,24.77 76.83,34.29 78.85,36.3 TELEINFO.2
N$4
  Top 0.406: R1.2 71.34,22.64 72.39,21.59 79.38,21.59 80.74,22.95 OK1.1
N$5
  Top 0.406: R1.1 69.97,26.79 68.58,25.4 68.58,23.5 71.44,20.64 81.6,20.64 83.19,22.23 83.19,30.48 82.39,31.27 TELEINFO.1
N$6
  Top 0.305: LED.MINUS R21.2
N$7
  Top 0.406: R3.2 OP1.3
N$8  (via drill 0.33 pad 0.61, 0.36 pad 0.61)
  Top 0.406: v34.29,60.33 33.34,59.37 v31.43,59.37
  Bottom 0.406: R4.2 34.77,60.8 v34.29,60.33 | OP2.3 31.11,59.05 v31.43,59.37
N$9
  Top 0.406: R5.2 OP3.3
N$10  (via drill 0.33 pad 0.61, 0.36 pad 0.61)
  Top 0.406: v34.29,55.24 33.34,54.29 v31.43,54.29
  Bottom 0.406: R6.2 34.66,55.62 v34.29,55.24 | OP4.3 31.11,53.98 v31.43,54.29
N$11
  Top 0.406: R7.2 OP5.3
N$12  (via drill 0.33 pad 0.56, 0.36 pad 0.61)
  Top 0.406: v34.29,50.16 33.34,49.21 v31.43,49.21
  Bottom 0.406: R8.2 34.66,50.53 v34.29,50.16 | OP6.3 31.11,48.9 v31.43,49.21
N$13
  Top 0.406: R9.2 OP7.3
N$14  (via drill 0.33 pad 0.56, 0.36 pad 0.61)
  Top 0.406: v34.29,45.09 33.34,44.13 v31.43,44.13
  Bottom 0.406: R10.2 34.66,45.45 v34.29,45.09 | OP8.3 31.11,43.81 v31.43,44.13
N$15
  Top 0.406: 26.67,2.54 26.69,2.54 RELAIS.-(4)
  Top 0.61: T1.C 26.02,1.89 26.67,2.54
N$16
  Top 0.61: C2.1 69.98,41.61 WS2812.2
  Bottom 0.406: WS2812.2 69.36,40.97 | 70.04,46.16 69.85,46.35
  Bottom 0.61: 69.36,40.97 70.04,41.66 70.04,46.16
N$17
  Top 0.406: T2.1 72.39,13.64 R2.2 77.18,15.58 OK1.3
N$18
  Top 0.406: R11.2 OP9.3
N$19  (via drill 0.36 pad 0.71)
  Top 0.406: 31.17,55.56 OP3.1 | 31.17,45.4 OP7.1 | 31.17,35.24 OP12.1
  Top 0.61: OP2.1 32.65,60.7 v33.01,60.64 | v33.01,55.56 31.17,55.56 | OP6.1 32.65,50.53 v33.01,50.48 | v33.01,45.4 31.17,45.4 | OP9.1 32.65,40.38 v33.01,40.32 | v33.01,35.24 31.17,35.24 | OP13.1 32.67,30.2 v33.01,30.16
  Bottom 0.305: LED.PLUS 73.66,31.75 76.9,34.99 76.9,49.09 74.3,51.69 OPTO.2 73.03,52.7
  Bottom 0.406: 31.17,60.64 OP2.1 | 31.17,50.48 OP6.1 | 31.17,40.32 OP9.1 | 31.25,30.16 OP14.1
  Bottom 0.508: v33.01,35.24 v33.01,40.32
  Bottom 0.61: v33.01,60.64 31.17,60.64 | OP3.1 32.65,55.62 v33.01,55.56 | v33.01,50.48 31.17,50.48 | OP7.1 32.65,45.45 v33.01,45.4 | 31.17,40.32 v33.01,40.32 v33.01,45.4 | OP12.1 32.65,35.3 v33.01,35.24 v33.01,30.16 31.25,30.16 | v33.01,60.64 v33.01,55.56 | v33.01,50.48 v33.01,55.56 | v33.01,45.4 v33.01,50.48 | OPTO.2 74.3,62.87 71.75,65.41 36.2,65.41 33.02,62.23 v33.02,60.65 v33.01,60.64
N$20
  Bottom 0.025: 0,3.81 0,63.5
N$21
  Top 0.406: T1.B 17.78,4.42 | 17.78,4.42 16.96,4.42 | R17.2 12.54,1.91 12.06,1.91 14.61,4.45 | 14.61,4.45 17.76,4.45 17.78,4.42 | R18.2 15.46,5.3 14.61,4.45
N$22
  Top 1.27: OP3.4 20.45,58.16 D3.2
N$24
  Top 1.27: OP5.4 20.45,53.08 D5.2
N$25
  Bottom 1.27: OP4.4 17.66,53.08 D4.1
N$26
  Top 1.27: OP7.4 20.45,47.99 D7.2
N$29
  Bottom 1.27: OP6.4 17.66,47.99 D6.1
N$31
  Bottom 1.27: OP8.4 17.66,42.91 D8.1
N$32  (via drill 0.33 pad 0.61, 0.36 pad 0.61)
  Top 0.406: v34.29,40.01 33.34,39.05 v31.43,39.05
  Bottom 0.406: R12.2 34.66,40.38 v34.29,40.01 | OP10.3 31.11,38.73 v31.43,39.05
N$34
  Bottom 0.406: OP14.3 31.78,27.75 32.85,28.82 34.29,28.82 R16.2
N$42
  Top 1.27: OP9.4 20.45,42.91 D9.2
N$47
  Top 0.406: R13.2 OP11.3
N$48  (via drill 0.36 pad 0.33, 0.36 pad 0.61)
  Top 0.406: v34.29,34.92 33.34,33.97 v31.43,33.97
  Bottom 0.406: R14.2 34.7,35.33 v34.29,34.92 | OP12.3 31.11,33.66 v31.43,33.97
N$49
  Bottom 1.27: OP10.4 17.66,37.84 D10.1
N$51
  Bottom 1.27: OP12.4 17.66,32.76 D12.1
NO
  Top 1.27: PH.2 22.53,18.62 RELAIS.1
PHASE  (via drill 0.64 pad 1.27)
  Top 1.27: OP2.6 26.87,60.7 27.37,60.2 27.37,55.24 | 27.37,55.24 27.37,49.85 | 27.37,49.85 27.37,44.77 | 27.37,44.77 27.37,39.69 | 27.37,39.69 27.37,34.61 | 27.37,34.61 27.37,29.21 | 27.37,29.21 27.37,26.73 26.04,25.4 v21.59,25.4 6.65,25.4 PH.1 | OP11.6 26.68,35.3 27.37,34.61 | OP13.6 26.38,30.2 27.37,29.21 | OP10.6 26.68,40.38 27.37,39.69 | OP8.6 26.68,45.45 27.37,44.77 | OP6.6 26.68,50.53 27.37,49.85 | OP4.6 27,55.62 27.37,55.24
  Bottom 0.813: 26.76,55.62 27.42,56.27 | 27.41,40.38 27.42,40.37 | 27.3,45.45 27.42,45.57 | 27.39,35.3 27.42,35.27 | OP14.6 24.32,30.3
  Bottom 1.27: 27.42,50.8 27.42,56.27 27.42,60.13 26.84,60.71 26.82,60.7 OP2.6 | 27.42,50.8 27.42,45.57 27.42,40.37 27.42,35.77 | 27.42,35.77 27.42,35.27 27.42,30.3 27.3,30.3 | OP4.6 26.76,55.62 | OP10.6 27.41,40.38 | OP8.6 27.3,45.45 | OP11.6 27.39,35.3 | 27.32,35.67 27.42,35.77 | OP14.6 27.3,30.3 | 27.3,30.3 27.43,30.17 27.43,26.92 25.94,25.43 21.62,25.43 v21.59,25.4 | OP6.6 27.15,50.53 27.42,50.8
RELAIS  (via drill 0.36 pad 0.71)
  Top 0.406: R17.1 15.83,1.86 v17.14,3.17
  Bottom 0.406: IC1.2 49.53,30.48 48.26,29.21 40.64,29.21 39.37,27.94 33.66,27.94 31.11,25.4 31.11,4.45 30.12,4.04 29.21,3.81 24.13,3.81 24.13,3.17 v17.14,3.17
RST  (via drill 0.36 pad 0.71)
  Top 0.305: PARTICLE.23 59.28,4.32
  Top 0.406: v49.15,43.31 49.15,51.18 46.98,53.34 IC1.18 | v64.14,15.88 59.28,11.02 59.28,4.32
  Top 0.61: JP4.11 PARTICLE.23
  Bottom 0.305: SPI_OLED.5 57.15,40.64 55.88,41.91 50.55,41.91 v49.15,43.31
  Bottom 0.406: v64.14,15.88 64.14,25.4 58.42,31.11 58.42,39.37 57.15,40.64
RX  (via drill 0.36 pad 0.71)
  Top 0.406: R22.1 71.12,6.35 71.5,6.73 T2.3 70.1,8.64 69.15,9.59 v69.15,10.48
  Top 0.61: JP3.9 54.17,22.13 PARTICLE.4
  Bottom 0.406: v69.15,10.48 65.66,13.97 55.88,13.97 54.17,15.68 PARTICLE.4
RX433
  Bottom 0.406: RX433.2 62.22,59.56 RX433.3 61.46,59.56 65.41,63.5 R23.1
S$1
  Top 1.27: OP11.4 20.45,37.84 D11.2
S$3
  Top 1.27: 17.66,30.2 D13.2 20.43,32.73 OP13.4
S$5
  Top 0.406: R15.2 31.22,32.84 OP13.3
S$11
  Bottom 0.813: OP14.4 24.18,27.75 | 17.66,27.75 D14.1
  Bottom 1.27: 17.66,27.75 OP14.4
SCK
  Top 0.305: 41.43,24.92 43.18,26.67 55.4,26.67 55.88,27.15 55.88,43.18 58.42,45.72 SPI_OLED.3
  Top 0.406: 41.43,24.92 41.43,24.7 JP3.4
  Top 0.61: 41.43,24.92 41.43,22.17 PARTICLE.9
  Bottom 0.203: 68.39,4.92 68.39,7.81
  Bottom 0.254: 68.39,1.33 69.22,0.51 71.63,0.51 72.39,1.27 72.39,3.81 73.39,4.81 U$3.SCK | 68.39,7.81 67.94,8.26 67.31,8.89 | 68.39,2.7 68.39,4.92
  Bottom 0.406: PARTICLE.9 41.48,15.68 46.99,10.16 66.04,10.16 67.94,8.26 | 68.39,1.33 U$2.SCK 68.39,2.7
SCL  (via drill 0.36 pad 0.71)
  Top 0.406: 36.42,4.32 PARTICLE.14 36.4,5.6 45.28,14.48 45.28,14.5 46.55,15.78 46.77,16 60.45,16 64.77,20.32 64.77,23.5 74.93,33.66 v74.93,39.56 75.82,40.45 JP1.2 | J2.1 70.36,55.12 68.58,53.34 68.58,51.95 R20.1 67.31,52.83 v66.67,52.83
  Top 0.61: JP4.2 PARTICLE.14
  Bottom 0.406: 57.15,53.72 58.04,52.83 v66.67,52.83 74.93,44.58 v74.93,39.56 | 57.15,53.72 54.99,55.88 IC1.12 | I2C_OLED.3 59.05,41.91 57.15,43.81 57.15,53.72
SDA  (via drill 0.36 pad 0.71)
  Top 0.406: PARTICLE.13 46.01,16.4 46.01,16.42 46.55,16.95 59.69,16.95 63.5,20.77 63.5,23.5 73.66,33.66 v73.66,34.42 73.66,41.27 75.37,42.99 v75.95,42.99 JP1.1 | 33.88,4.32 PARTICLE.13 | 33.91,4.29 PARTICLE.13 | v66.8,54.29 65.53,55.56 R19.1 68.47,58.69 J2.2
  Top 0.61: JP4.1 PARTICLE.13
  Bottom 0.305: I2C_OLED.4 63.5,39.37 68.45,34.42 v73.66,34.42
  Bottom 0.406: IC1.13 55.24,58.42 59.37,54.29 v66.8,54.29 75.95,45.15 v75.95,42.99
SS
  Top 0.61: JP3.3 38.92,22.13 PARTICLE.10
  Bottom 0.406: PARTICLE.10 38.94,16.95 46.99,8.89 64.98,8.89 U$3.NSS 66.39,5.48 U$2.SEL
TX
  Top 0.61: JP3.10 56.71,22.13 PARTICLE.3
VDDA
  Top 0.61: JP4.10 PARTICLE.22

### Text on the board
tPlace: Programmateur Fil Pilote Remora | v1.4-02/2017
tNames: GND | 5V | D4 | D4 | GND | 3V3 | SDA | 3V3 | FP1 | SCL | GND | FP2 | GND | 5V | FP3 | 3V3 | 3V3 | SCK | GND | FP4 | MOS | SDA | SCL | SCL | RST | SDA | FP5 | I2C | D7 | I2 | D6 | SPI | FP6 | I1 | GPB0 | FP7 | + | A0 | VIN | DAC | WKP | A0 | A1 | A2 | A3 | A4 | A5 | A6 | A7 | RX | TX | GND | VIN | NO | COM | Spark Core / Photon | 3V3* | VBAT | Antenne RF | D0 | SDA | D1 | SCL | D2 | D3 | D4 | D5 | D6 | D7 | GND | RST | 3V3 | D0 | 3V3
bNames: R23 et R24 seulement si récepteur RX433 / Particle R23 Seulement / NodeMCU R23 et R24 | GND | FP1 | 3V3 | SDA | 3V3 | 5V | D4 | D4 | GND | SCL | 3V3 | FP2 | 5V | GND | GND | FP3 | 3V3 | 3V3 | 5V | +5V | SCK | FP4 | 3V3 | GND | MOS | SDA | SCL | RST | FP5 | SDA | SCL | D7 | I2C | I2 | D6 | FP6 | SPI | I1 | FP7 | TELEINO | GPB0 | Ph | NO | GND | VIN | COM | GND | 3V3 | Ant